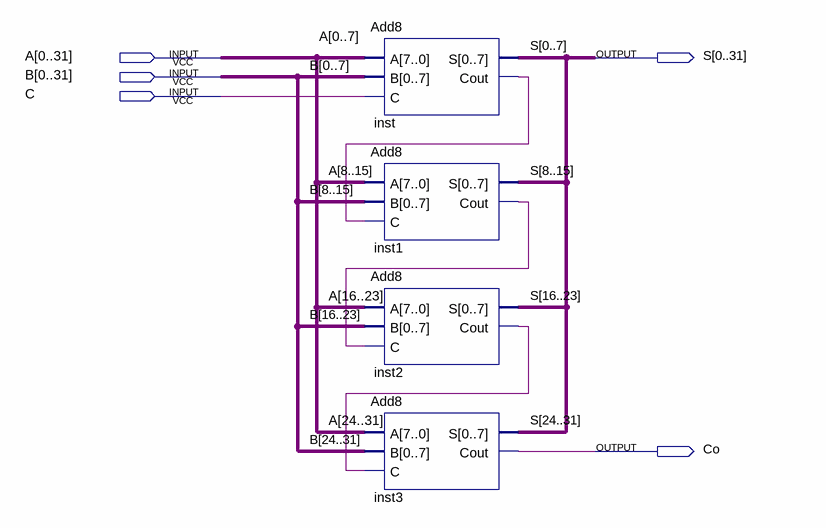
[diagram p0: schematic sheet]
// Quartus schematic Add32.bdf as structural Verilog: 4 symbols, 5 pins
module Add32 (
  input  [0:31] A,
  input  [0:31] B,
  input  C,
  output [0:31] S,
  output Co
);

  wire inst1_cout, inst2_cout, inst_cout;

  Add8 inst (.A(A[0:7]), .B(B[0:7]), .C(C), .S(S[0:7]), .Cout(inst_cout));
  Add8 inst1 (.A(A[8:15]), .B(B[8:15]), .C(inst_cout), .S(S[8:15]), .Cout(inst1_cout));
  Add8 inst2 (.A(A[16:23]), .B(B[16:23]), .C(inst1_cout), .S(S[16:23]), .Cout(inst2_cout));
  Add8 inst3 (.A(A[24:31]), .B(B[24:31]), .C(inst2_cout), .S(S[24:31]), .Cout(Co));
endmodule
